# EAGLE design UnicornPin (EAGLE 7.7.0)
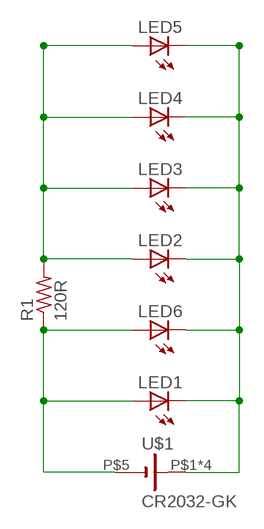
[diagram p0: schematic, sheet 1]

## Parts
LED1  LED5MM  [LED5MM]
LED2  LED3MM  [LED3MM]
LED3  LED3MM  [LED3MM]
LED4  LED3MM  [LED3MM]
LED5  LED3MM  [LED3MM]
LED6  LED5MM  [LED5MM]
R1  120R  R-US_0207/7  [0207/7]
U$1  CR2032-GK  [BAT-HLD-001-THM]

## Nets
N$1: LED1.A LED6.A R1.1 U$1.P$5(-)
N$2: LED1.K(C) LED2.K(C) LED3.K(C) LED4.K(C) LED5.K(C) LED6.K(C) U$1.P$1(+) U$1.P$2(+) U$1.P$3(+) U$1.P$4(+)
N$3: LED2.A LED3.A LED4.A LED5.A R1.2

## Library data of the parts
LED1-LED6 = led:LED: LED OSRAM: - CHIPLED LG R971, LG N971, LY N971, LG Q971, LY Q971, LO R971, LY R971 LH N974, LH R974 LS Q976, LO Q976, LY Q976 LO Q996 - Hyper CHIPLED LW Q18S LB Q993, LB Q99A, LB R99A - SideLED LS A670, LO A670, LY A670, LG A670, LP A670 LB A673, LV A673, LT A673, LW A673 LH A674 LY A675 LS A676, LA A676, LO A676, LY A676, LW A676 LS A679, LY A679, LG A679 - Hyper Micro SIDELED® LS Y876, LA Y876, LO Y876, LY Y876 LT Y87S - SmartLED LW L88C, LW L88S LB L89C, LB L89S, LG L890 LS L89K, LO L89K, LY L89K LS L896, LA L896, LO L896, LY L896 - TOPLED LS T670, LO T670, LY T670, LG T670, LP T670 LSG T670, LSP T670, LSY T670, LOP T670, LYG T670 LG T671, LOG T671, LSG T671 LB T673, LV T673, LT T673, LW T673 LH T674 LS T676, LA T676, LO T676, LY T676, LB T676, LH T676, LSB T676, LW T676 LB T67C, LV T67C, LT T67C, LS T67K, LO T67K, LY T67K, LW E67C LS E67B, LA E67B, LO E67B, LY E67B, LB E67C, LV E67C, LT E67C LW T67C LS T679, LY T679, LG T679 LS T770, LO T770, LY T770, LG T770, LP T770 LB T773, LV T773, LT T773, LW T773 LH T774 LS E675, LA E675, LY E675, LS T675 LS T776, LA T776, LO T776, LY T776, LB T776 LHGB T686 LT T68C, LB T68C - Hyper Mini TOPLED® LB M676 - Mini TOPLED Santana® LG M470 LS M47K, LO M47K, LY M47K Source: http://www.osram.convergy.de LUXEON: - LUMILED® LXK2-PW12-R00, LXK2-PW12-S00, LXK2-PW14-U00, LXK2-PW14-V00 LXK2-PM12-R00, LXK2-PM12-S00, LXK2-PM14-U00 LXK2-PE12-Q00, LXK2-PE12-R00, LXK2-PE12-S00, LXK2-PE14-T00, LXK2-PE14-U00 LXK2-PB12-K00, LXK2-PB12-L00, LXK2-PB12-M00, LXK2-PB14-N00, LXK2-PB14-P00, LXK2-PB14-Q00 LXK2-PR12-L00, LXK2-PR12-M00, LXK2-PR14-Q00, LXK2-PR14-R00 LXK2-PD12-Q00, LXK2-PD12-R00, LXK2-PD12-S00 LXK2-PH12-R00, LXK2-PH12-S00 LXK2-PL12-P00, LXK2-PL12-Q00, LXK2-PL12-R00 Source: www.luxeon.com KINGBRIGHT: KA-3528ASYC Source: www.kingbright.com
R1 = resistor:R-US_: RESISTOR, American symbol
U$1 = battery:CR2032-GK

## Board
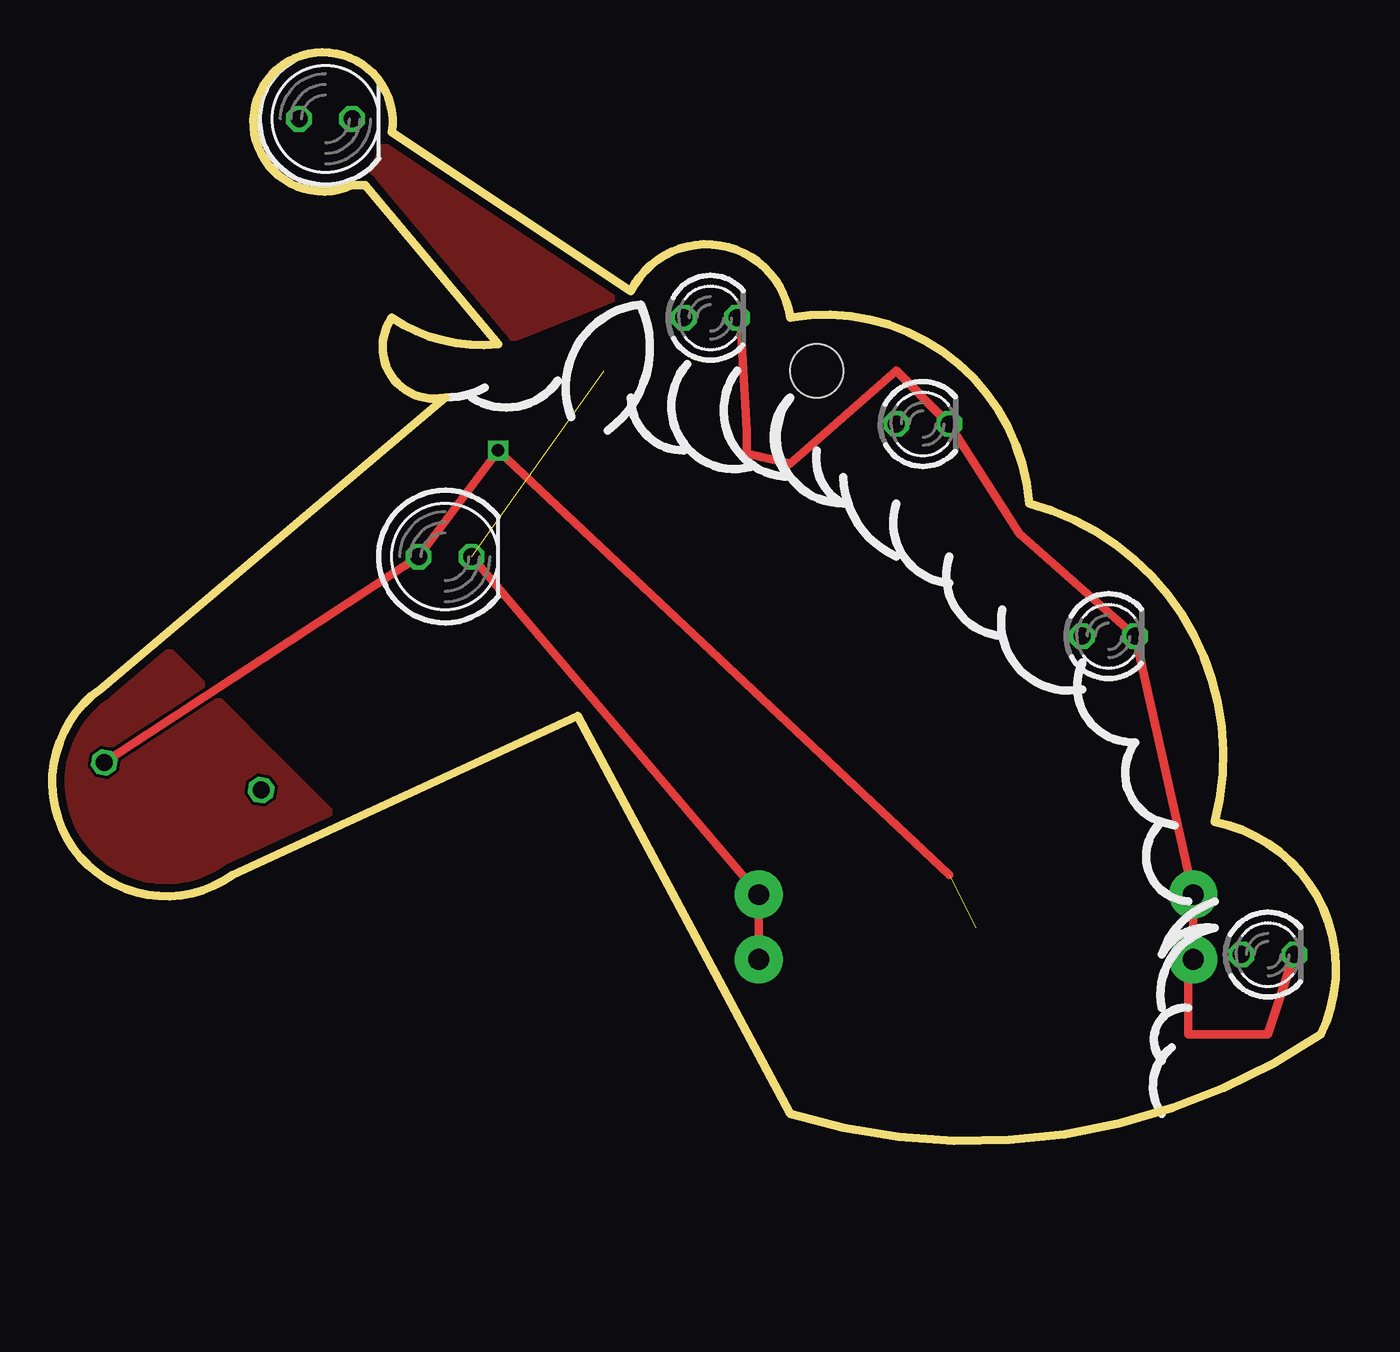
[diagram p1: board, top side]
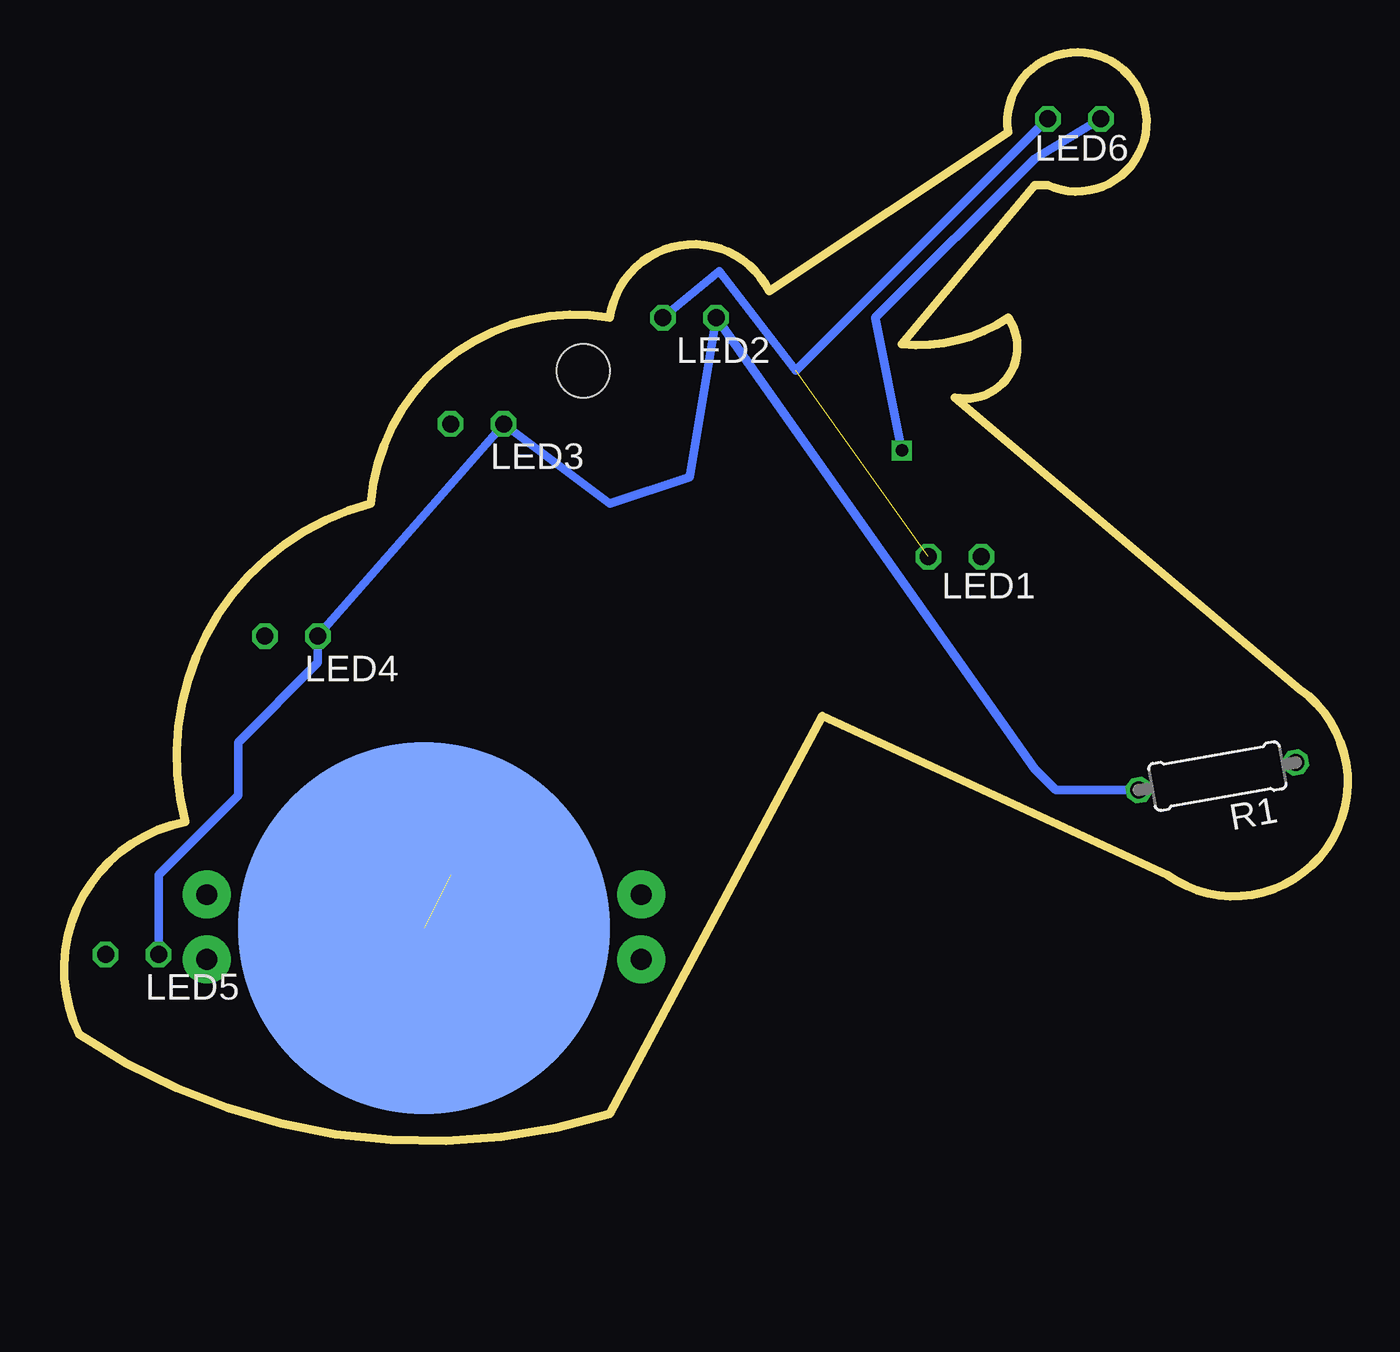
[diagram p2: board, bottom side, seen from below]

Size 61.41 x 52.1 mm. Coordinates in mm from the lower left corner, seen from the top.
Outline: 27.68,40.66 arc-146 35.3,39.39 arc-96 46.73,30.5 arc-90 55.62,15.26 arc-105 60.7,5.1 arc-51 35.3,1.29 25.14,20.34 8.63,12.72 arc-180 2.28,21.61 18.79,35.58 arc-138 16.25,39.39 arc40 21.33,38.12 14.98,45.74 14.35,45.74 arc-303 16.25,48.28 27.68,40.66
Copper layers (1*16): Top 0.0356mm / dielectric 1.5011mm / Bottom 0.0356mm
Design rules "oshpark-2layer": minimum track width 6mil, minimum drill 13mil, track to track 6mil, track to pad 6mil, pad to pad 6mil, via to via 6mil, smd to smd 6mil, copper to edge 15mil, drill to drill 6mil, minimum pad ring 7mil, minimum via ring 7mil, stop-mask expansion 2.5mil, vias tented up to drill 0mil, thermal gap 10mil
Holes 2.54 mm at 36.57,36.85

### Footprints (pad centres in the part's own frame; a part is rotated, then mirrored left to right if it is on the bottom)
LED5MM = drill 0.813 octagon: A -1.27,0; K 1.27,0
LED3MM = drill 0.813 octagon: A -1.27,0; K 1.27,0
0207/7 = drill 0.813 octagon: 1 -3.81,0; 2 3.81,0
BAT-HLD-001-THM = drill 1 pad 2.3: P$1 10.4,1.5; P$2 10.4,-1.6; P$3 -10.4,1.5; P$4 -10.4,-1.6 | smd 17.8 x 17.8: P$5 0,0

### Placement (x,y rotation side)
LED1  18.79,27.96 0 top
LED2  31.49,39.39 0 top
LED3  41.65,34.31 0 top
LED4  50.54,24.15 0 top
LED5  58.16,8.91 0 top
LED6  13.08,48.92 0 top
R1  6.24,17.45 190 bottom
U$1  44.19,10.18 180 bottom

### Tracks (layer width: path | path; a pad name or v marks a point on that pad's centre or on a via)
N$1  (via drill 0.6)  (1 unrouted)
  Top 0.406: R1.1 LED1.A v21.33,33.04 42.92,12.72
  Bottom 0.406: v21.33,33.04 22.6,39.39 14.98,47.01 LED6.A
N$2  (1 unrouted)
  Top 0.406: LED2.K 32.92,39.39 33.24,33.99 33.24,32.88 35.3,32.41 40.38,36.85 LED3.K 46.26,29.07 LED4.K U$1.P$2 U$1.P$1 54.74,8.36 54.35,7.97 54.35,5.1 58.16,5.1 LED5.K | LED1.K U$1.P$4 U$1.P$3
  Bottom 0.406: LED6.K 26.41,36.85 30.07,41.61 LED2.K
N$3
  Bottom 0.406: R1.2 13.97,16.78 14.98,17.8 LED2.A 31.49,31.77 35.3,30.5 LED3.A LED4.A 49.27,22.88 53.08,19.07 53.08,16.53 56.89,12.72 LED5.A
N$6
  pour Top: 21.33,38.12 27.68,40.66 16.25,48.28 14.98,45.74
N$7
  pour Top: 4.82,24.15 13.71,15.26 6.09,11.45 1.33,12.88 -0.26,17.8 1.01,20.34